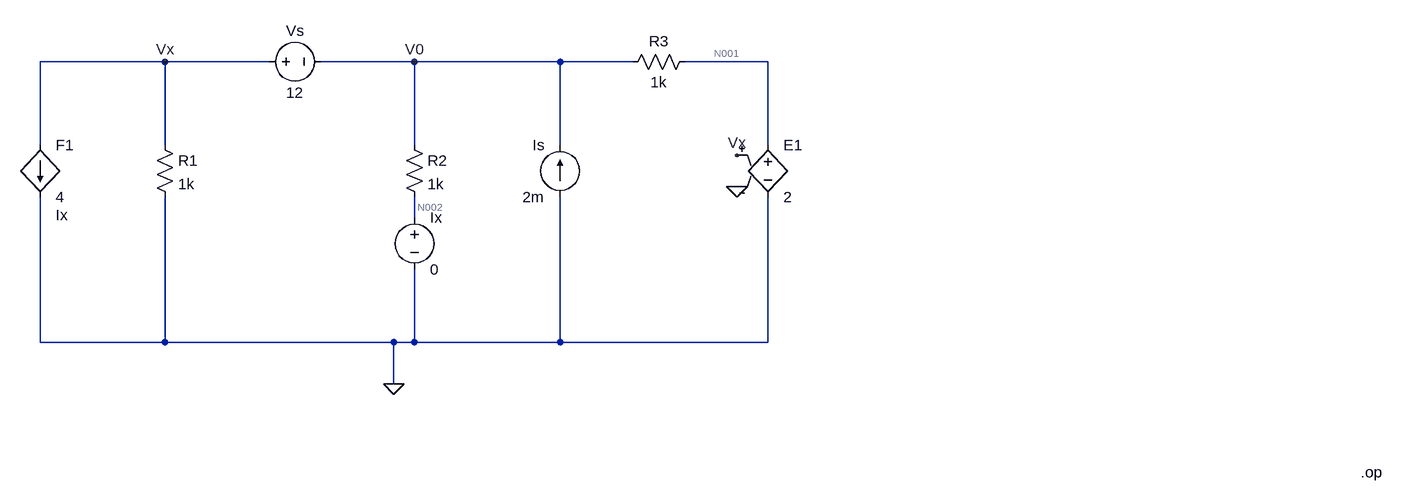
[diagram p0: schematic HW02-04.asc]
HW02-04.asc, the LTspice schematic file:
Version 4
SHEET 1 2248 680
WIRE 368 0 176 0
WIRE 528 0 368 0
WIRE 752 0 608 0
WIRE 976 0 752 0
WIRE 1088 0 976 0
WIRE 1296 0 1168 0
WIRE 176 128 176 0
WIRE 368 128 368 0
WIRE 752 128 752 0
WIRE 976 128 976 0
WIRE 1296 128 1296 0
WIRE 752 240 752 208
WIRE 176 432 176 208
WIRE 368 432 368 208
WIRE 368 432 176 432
WIRE 720 432 368 432
WIRE 752 432 752 320
WIRE 752 432 720 432
WIRE 976 432 976 208
WIRE 976 432 752 432
WIRE 1296 432 1296 208
WIRE 1296 432 976 432
WIRE 720 496 720 432
FLAG 368 0 Vx
FLAG 752 0 V0
FLAG 720 496 0
FLAG 1248 144 Vx
FLAG 1248 192 0
SYMBOL f 176 128 R0
WINDOW 38 24 108 Left 2
SYMATTR InstName F1
SYMATTR Value 4
SYMATTR SpiceModel Ix
SYMBOL res 352 112 R0
SYMATTR InstName R1
SYMATTR Value 1k
SYMBOL voltage 752 224 R0
SYMATTR InstName Ix
SYMATTR Value 0
SYMBOL voltage 512 0 R270
WINDOW 0 32 56 VTop 2
WINDOW 3 -32 56 VBottom 2
SYMATTR InstName Vs
SYMATTR Value 12
SYMBOL res 736 112 R0
SYMATTR InstName R2
SYMATTR Value 1k
SYMBOL current 976 208 R180
WINDOW 0 24 80 Left 2
WINDOW 3 24 0 Left 2
SYMATTR InstName Is
SYMATTR Value 2m
SYMBOL res 1184 -16 R90
WINDOW 0 0 56 VBottom 2
WINDOW 3 32 56 VTop 2
SYMATTR InstName R3
SYMATTR Value 1k
SYMBOL e 1296 112 R0
SYMATTR InstName E1
SYMATTR Value 2
TEXT 2208 632 Left 2 !.op

The netlist it stands for:
* HW02-04.asc
F1 Vx 0 Ix 4
R1 Vx 0 1k
V§Ix N002 0 0
Vs Vx V0 12
R2 V0 N002 1k
Is 0 V0 2m
R3 N001 V0 1k
E1 N001 0 Vx 0 2
.op
.backanno
.end

* Results of the author's LTspice run, read from the files saved beside the schematic
* Operating Point:
*   V(vx) = 14.8 V
*   V(n002) = 0 V
*   V(v0) = 2.8 V
*   V(n001) = 29.6 V
*   I(F1) = 11.2 mA
*   I(Is) = 2 mA
*   I(R1) = 14.8 mA
*   I(R2) = 2.8 mA
*   I(R3) = 26.8 mA
*   I(E1) = -26.8 mA
*   I(Ix) = 2.8 mA
*   I(Vs) = -26 mA